# Altium schematic sheet Steering_IOSch.SchDoc
size A; SheetNumber: 2; SheetTotal: 2
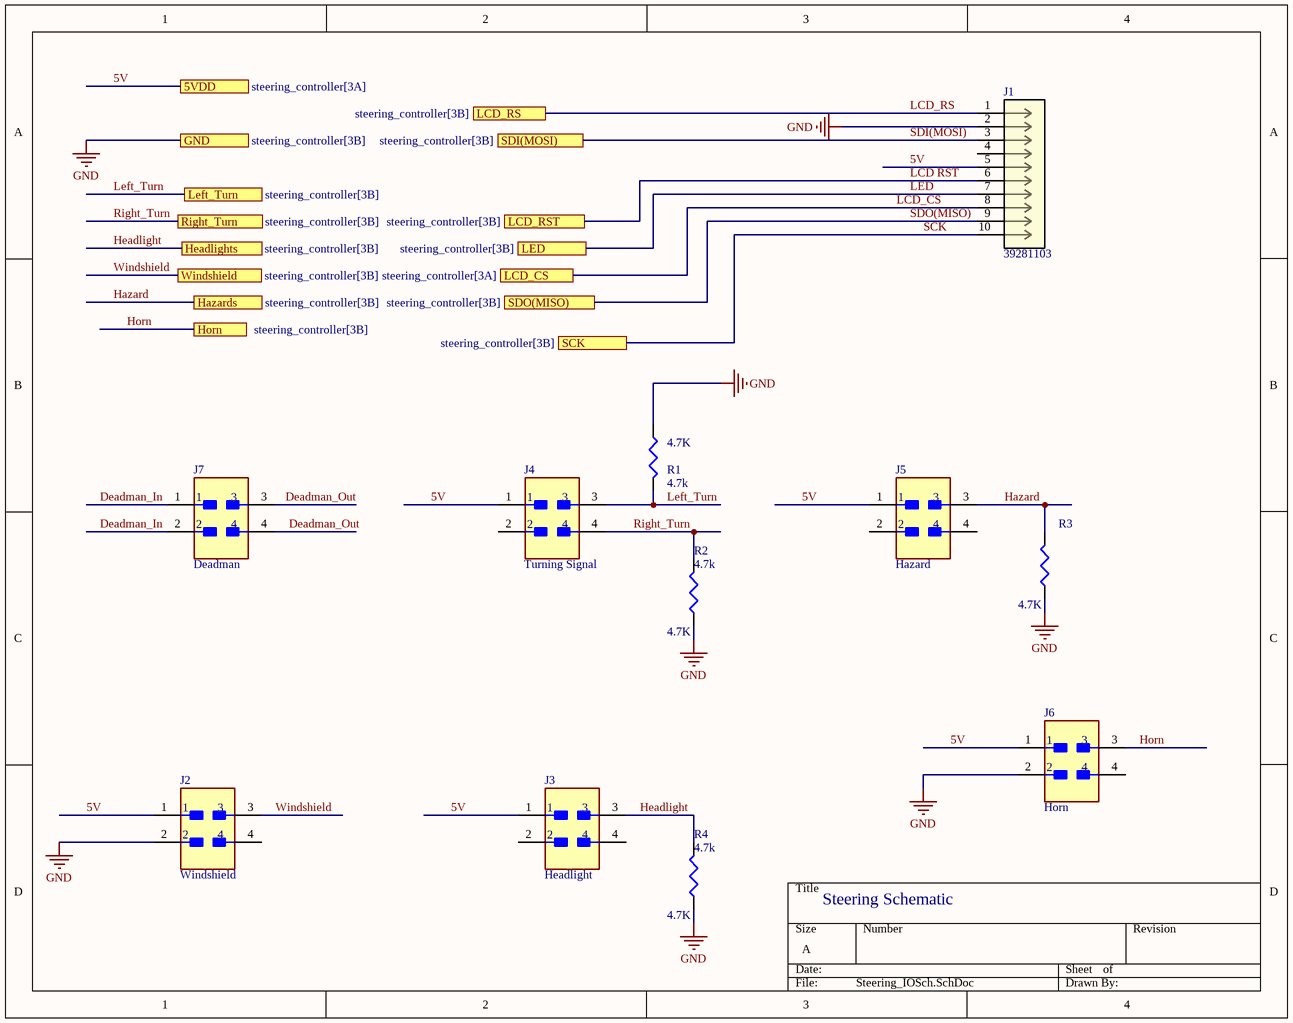
[diagram p0: Steering_IOSch.SchDoc]

## Parts
J1  39281103  [CON_39281103]
J2  Windshield  [FP-0039281043-MFG]
J3  Headlight  [FP-0039281043-MFG]
J4  Turning Signal  [FP-0039281043-MFG]
J5  Hazard  [FP-0039281043-MFG]
J6  Horn  [FP-0039281043-MFG]
J7  Deadman  [FP-0039281043-MFG]
R1  4.7k  [0603r]
R2  4.7k  [0603r]
R3  value 4.7K  [0603r]
R4  4.7k  [0603r]

## Ports
5VDD (see steering_controller[3A]), GND (see steering_controller[3B]), Hazards (see steering_controller[3B]), Headlights (see steering_controller[3B]), Horn (see steering_controller[3B]), LCD_CS (see steering_controller[3A]), LCD_RS (see steering_controller[3B]), LCD_RST (see steering_controller[3B]), LED (see steering_controller[3B]), Left_Turn (see steering_controller[3B]), Right_Turn (see steering_controller[3B]), SCK (see steering_controller[3B]), SDI(MOSI) (see steering_controller[3B]), SDO(MISO) (see steering_controller[3B]), Windshield (see steering_controller[3B])

## Nets
GND: J1.2 J2.2 J6.2 R1.1 R2.1 R3.1 R4.1 ; port GND
5V: J1.5 J2.1 J3.1 J4.1 J5.1 J6.1 ; port 5VDD
Deadman_In: J7.1 J7.2
Deadman_Out: J7.3 J7.4
Hazard: J5.3 R3.2 ; port Hazards
Headlight: J3.3 R4.2 ; port Headlights
Horn: J6.3 ; port Horn
LCD RST: J1.6 ; port LCD_RST
LCD_CS: J1.8 ; port LCD_CS
LCD_RS: J1.1 ; port LCD_RS
LED: J1.7 ; port LED
Left_Turn: J4.3 R1.2 ; port Left_Turn
Right_Turn: J4.4 R2.2 ; port Right_Turn
SCK: J1.10 ; port SCK
SDI(MOSI): J1.3 ; port SDI(MOSI)
SDO(MISO): J1.9 ; port SDO(MISO)
Windshield: J2.3 ; port Windshield

Not connected (* = marked no-connect by the designer): J1 4; J2 4; J3 2 4; J4 2; J5 2 4; J6 4

## Notes on the sheet
- Steering Schematic

## Library data of the parts
J1 = 39281103: No Description Available; Mfr_Name: Molex Connector Corporation; RefDes: RefDes; Type: Type
J2-J7 = 1x4_FEMALE_POWER: CONN HEADER VERT 4POS 4.2MM. 0039281043; Manufacturer: Molex; Conn Orientation: Vertical; Conn Gender: Male; Current Rating: 9A; Voltage Rating: 600V; Number Of Contacts: 4; Pitch: 4.2mm; Manufacturer Part Number: 0039281043; Lead Free: Yes; Category: Conn; Height: 13.1mm; ComponentLink2URL: https://www.molex.com/webdocs/datasheets/pdf/en-us/0039281043_PCB_HEADERS.pdf; Package: 0; Device Class L2: Headers and Wire Housings; Contact Material: Tin; Footprint Url: https://www.molex.com/pdm_docs/sd/039281043_sd.pdf; Device Class L1: Connectors; Temperature Range High: +105°C; Automotive: No; RoHS: TRUE; Temperature: -40°C to +105°C; Number Of Rows: 2; Digikey Description: CONN HEADER VERT 4POS 4.2MM; Temperature Range Low: -40°C; Octopart: https://octopart.com/39-28-1043-molex-7613; Device Class L3: unset; ComponentLink2Description: Datasheet
R1-R4 = Res3: SMD Resistor; Published: 8-Jun-2000; LatestRevisionDate: 29-May-2009; LatestRevisionNote: IPC-7351 Footprint Added.; PackageReference: J1-0603; Publisher: Altium Limited; PackageDescription: Chip Resistor
  R1 R2 R4: Value: 4.7K